# Altium schematic sheet t1-power2.SchDoc
size A3
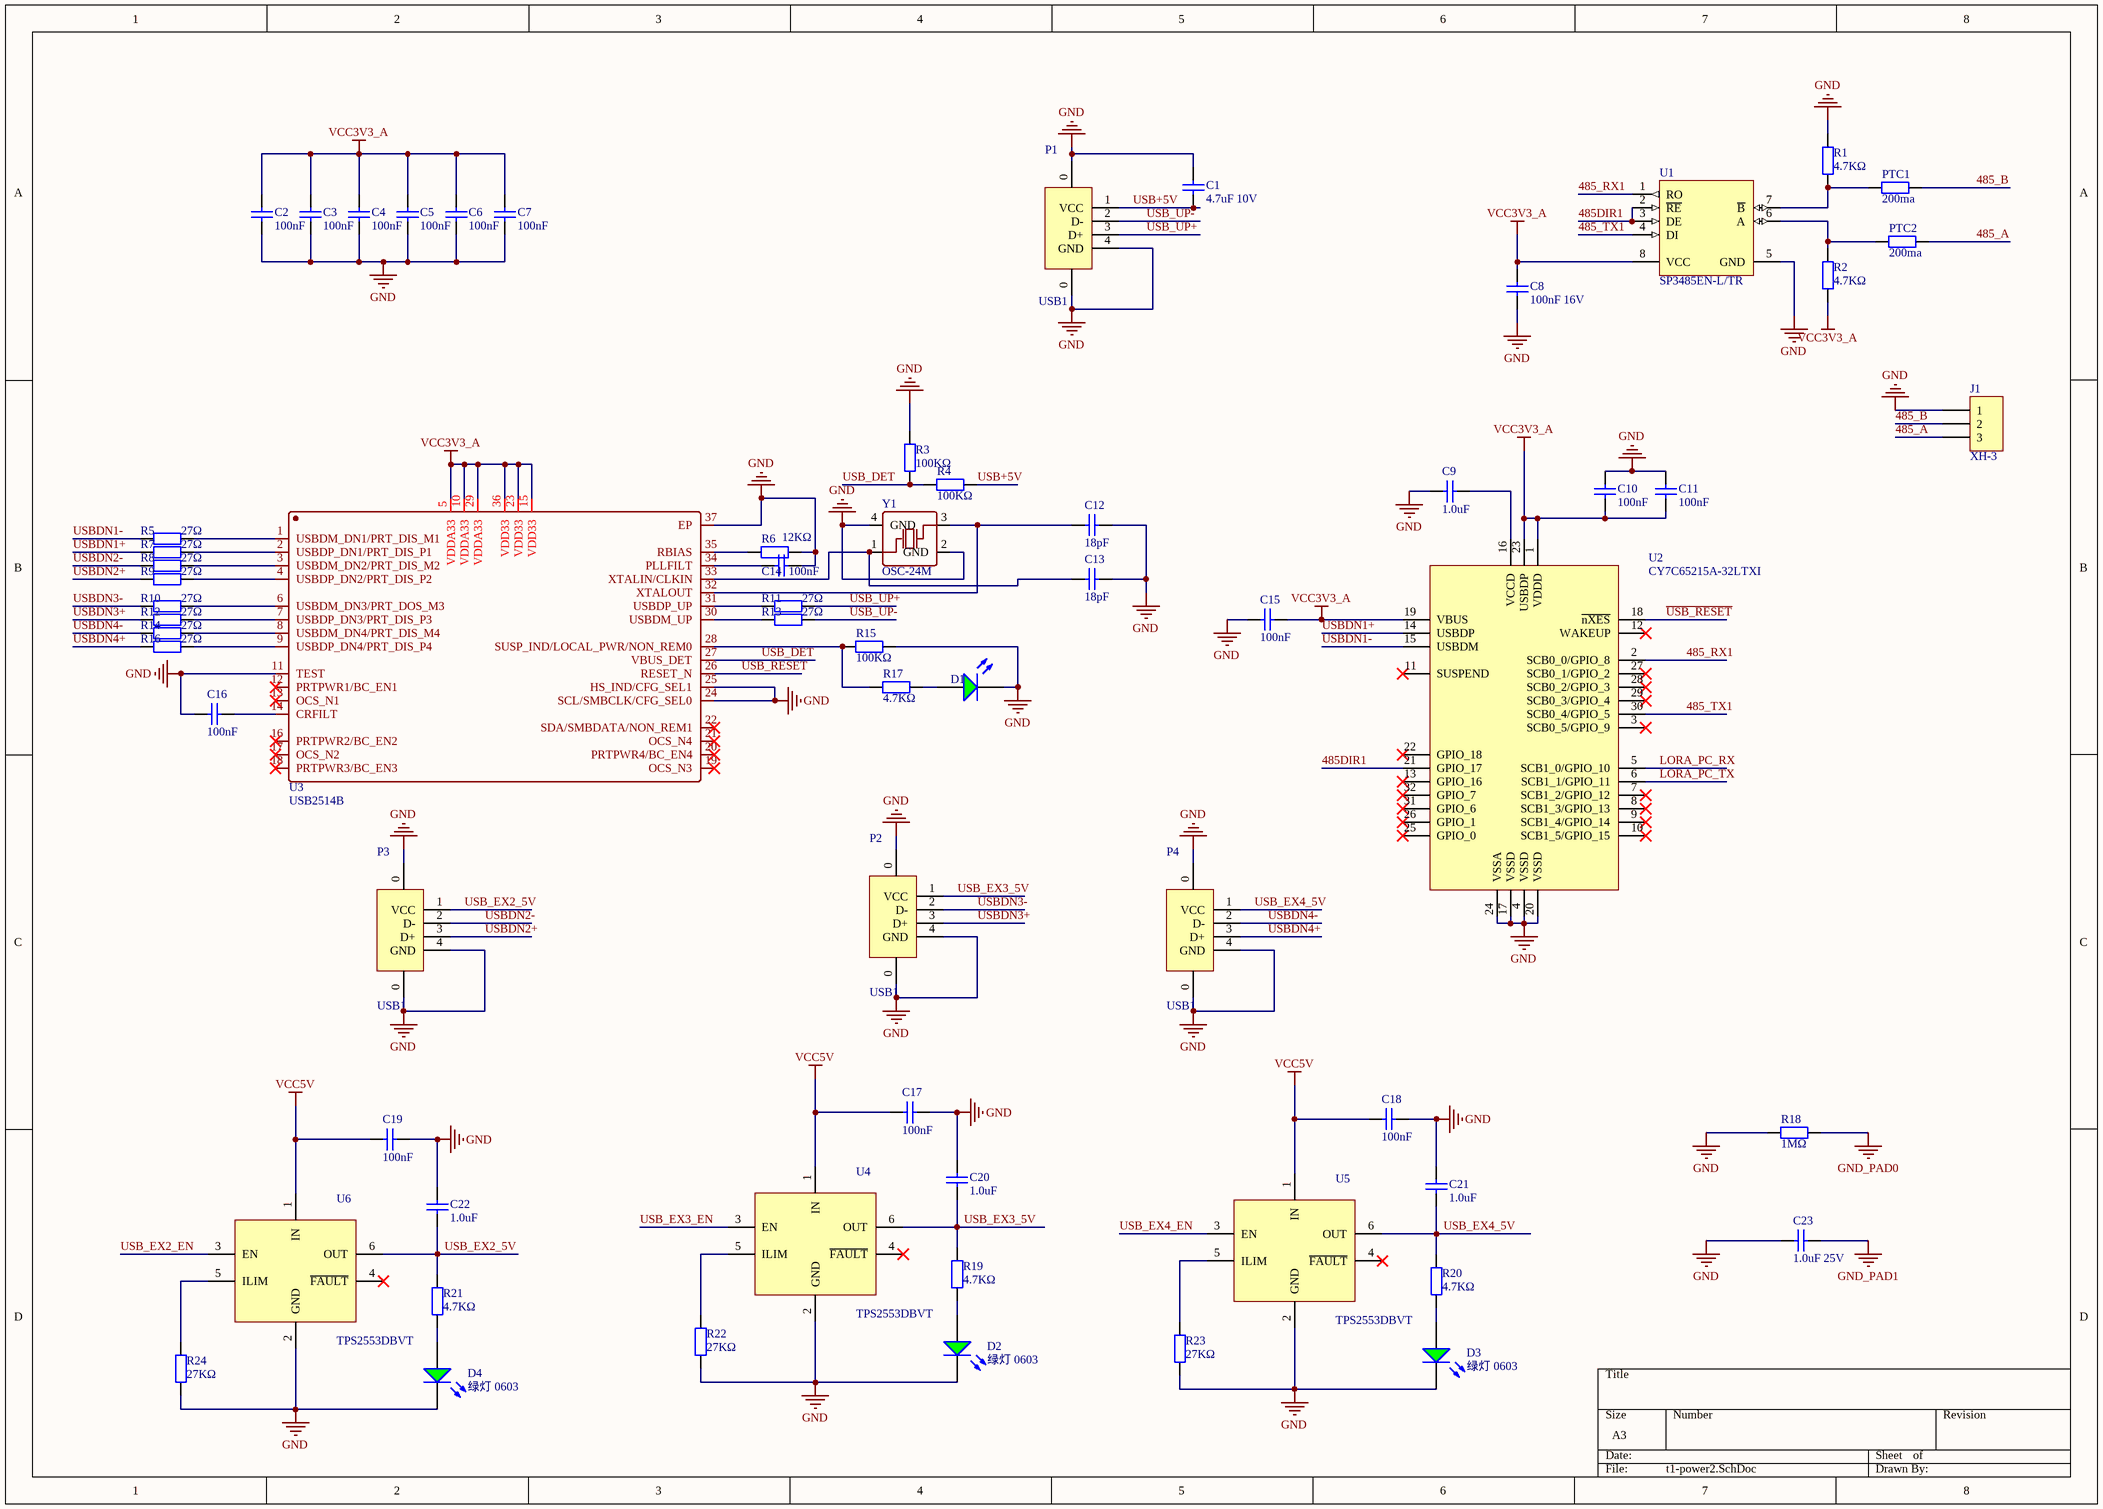
[diagram p0: t1-power2.SchDoc]

## Parts
C1  4.7uF 10V  [0402_C]
C2  100nF  [0402_C]
C3  100nF  [0402_C]
C4  100nF  [0402_C]
C5  100nF  [0402_C]
C6  100nF  [0402_C]
C7  100nF  [0402_C]
C8  100nF 16V  [0402_C]
C9  1.0uF  [0402_C]
C10  100nF  [0402_C]
C11  100nF  [0402_C]
C12  18pF  [0402_C]
C13  18pF  [0402_C]
C14  100nF  [0402_C]
C15  100nF  [0402_C]
C16  100nF  [0402_C]
C17  100nF  [0402_C]
C18  100nF  [0402_C]
C19  100nF  [0402_C]
C20  1.0uF  [0402_C]
C21  1.0uF  [0402_C]
C22  1.0uF  [0402_C]
C23  1.0uF 25V  [0402_C]
D1  绿灯 0603  [0603_LED_S1]  (value not drawn)
D2  绿灯 0603  [0603_LED_S1]
D3  绿灯 0603  [0603_LED_S1]
D4  绿灯 0603  [0603_LED_S1]
J1  XH-3  [ph3-2.0]
P1  USB1  [USB-B]
P2  USB1  [USB - Type A]
P3  USB1  [USB - Type A]
P4  USB1  [USB - Type A]
PTC1  200ma  [0603_R]
PTC2  200ma  [0603_R]
R1  4.7KΩ  [0402_R]
R2  4.7KΩ  [0402_R]
R3  100KΩ  [0402_R]
R4  100KΩ  [0402_R]
R5  27Ω  [0402_R]
R6  12KΩ  [0402_R]
R7  27Ω  [0402_R]
R8  27Ω  [0402_R]
R9  27Ω  [0402_R]
R10  27Ω  [0402_R]
R11  27Ω  [0402_R]
R12  27Ω  [0402_R]
R13  27Ω  [0402_R]
R14  27Ω  [0402_R]
R15  100KΩ  [0402_R]
R16  27Ω  [0402_R]
R17  4.7KΩ  [0402_R]
R18  1MΩ  [0402_R]
R19  4.7KΩ  [0402_R]
R20  4.7KΩ  [0402_R]
R21  4.7KΩ  [0402_R]
R22  27KΩ  [0402_R]
R23  27KΩ  [0402_R]
R24  27KΩ  [0402_R]
U1  SP3485EN-L/TR  [SOIC-8_150mil]
U2  CY7C65215A-32LTXI  [QFN-32_5X5]
U3  USB2514B
U4  TPS2553DBVT  [SOT-23-6]
U5  TPS2553DBVT  [SOT-23-6]
U6  TPS2553DBVT  [SOT-23-6]
Y1  OSC-24M

## Nets
GND: C1.2 C2.1 C3.1 C4.1 C5.1 C6.1 C7.1 C8.1 C9.1 C10.2 C11.2 C12.2 C13.2 C14.2 C15.2 C16.1 C17.2 C18.2 C19.2 C20.2 C21.2 C22.2 C23.1 D1.K D2.K D3.K D4.K J1.1 P1.0 P1.4(GND) P2.0 P2.4(GND) P3.0 P3.4(GND) P4.0 P4.4(GND) R1.2 R3.2 R6.2 R15.2 R18.1 R22.1 R23.1 R24.1 U1.5(GND) U2.4(VSSD) U2.17(VSSD) U2.20(VSSD) U2.24(VSSA) U3.11(TEST) U3.24(SCL/SMBCLK/CFG_SEL0) U3.25(HS_IND/CFG_SEL1) U3.37(EP) U4.2(GND) U5.2(GND) U6.2(GND) Y1.2(GND) Y1.4(GND)
GND_PAD0: R18.2
GND_PAD1: C23.2
VCC3V3_A: C2.2 C3.2 C4.2 C5.2 C6.2 C7.2 C8.2 C10.1 C11.1 C15.1 R2.1 U1.8(VCC) U2.1(VDDD) U2.19(VBUS) U2.23(USBDP) U3.5(VDDA33) U3.10(VDDA33) U3.15(VDD33) U3.23(VDD33) U3.29(VDDA33) U3.36(VDD33)
VCC5V: C17.1 C18.1 C19.1 U4.1(IN) U5.1(IN) U6.1(IN)
485_A: J1.3 PTC2.2
485_B: J1.2 PTC1.2
485_RX1: U1.1(RO) U2.2(SCB0_0/GPIO_8)
485_TX1: U1.4(DI) U2.30(SCB0_4/GPIO_5)
485DIR1: U1.2(~{RE}) U1.3(DE) U2.21(GPIO_17)
LORA_PC_RX: U2.5(SCB1_0/GPIO_10)
LORA_PC_TX: U2.6(SCB1_1/GPIO_11)
~{USB_RESET}: U2.18(~{nXES}) U3.26(RESET_N)
USB+5V: C1.1 P1.1(VCC) R4.2
USB_DET: R3.1 R4.1 U3.27(VBUS_DET)
USB_EX2_5V: C22.1 P3.1(VCC) R21.2 U6.6(OUT)
USB_EX2_EN: U6.3(EN)
USB_EX3_5V: C20.1 P2.1(VCC) R19.2 U4.6(OUT)
USB_EX3_EN: U4.3(EN)
USB_EX4_5V: C21.1 P4.1(VCC) R20.2 U5.6(OUT)
USB_EX4_EN: U5.3(EN)
USB_UP+: P1.3(D+) R11.2
USB_UP-: P1.2(D-) R13.2
USBDN1+: R7.1 U2.14(USBDP)
USBDN1-: R5.1 U2.15(USBDM)
USBDN2+: P3.3(D+) R9.1
USBDN2-: P3.2(D-) R8.1
USBDN3+: P2.3(D+) R12.1
USBDN3-: P2.2(D-) R10.1
USBDN4+: P4.3(D+) R16.1
USBDN4-: P4.2(D-) R14.1
NetC9_2: C9.2 U2.16(VCCD)
NetC12_1: C12.1 U3.32(XTALOUT) Y1.3(OSC2)
NetC13_1: C13.1 U3.33(XTALIN/CLKIN) Y1.1(OSC1)
NetC14_1: C14.1 U3.34(PLLFILT)
NetC16_2: C16.2 U3.14(CRFILT)
NetD1_A: D1.A R17.2
NetD2_A: D2.A R19.1
NetD3_A: D3.A R20.1
NetD4_A: D4.A R21.1
NetPTC1_1: PTC1.1 R1.1 U1.7(~{B})
NetPTC2_1: PTC2.1 R2.2 U1.6(A)
NetR5_2: R5.2 U3.1(USBDM_DN1/PRT_DIS_M1)
NetR6_1: R6.1 U3.35(RBIAS)
NetR7_2: R7.2 U3.2(USBDP_DN1/PRT_DIS_P1)
NetR8_2: R8.2 U3.3(USBDM_DN2/PRT_DIS_M2)
NetR9_2: R9.2 U3.4(USBDP_DN2/PRT_DIS_P2)
NetR10_2: R10.2 U3.6(USBDM_DN3/PRT_DOS_M3)
NetR11_1: R11.1 U3.31(USBDP_UP)
NetR12_2: R12.2 U3.7(USBDP_DN3/PRT_DIS_P3)
NetR13_1: R13.1 U3.30(USBDM_UP)
NetR14_2: R14.2 U3.8(USBDM_DN4/PRT_DIS_M4)
NetR15_1: R15.1 R17.1 U3.28(SUSP_IND/LOCAL_PWR/NON_REM0)
NetR16_2: R16.2 U3.9(USBDP_DN4/PRT_DIS_P4)
NetR22_2: R22.2 U4.5(ILIM)
NetR23_2: R23.2 U5.5(ILIM)
NetR24_2: R24.2 U6.5(ILIM)

Not connected (* = marked no-connect by the designer): U2 3(SCB0_5/GPIO_9)* 7(SCB1_2/GPIO_12)* 8(SCB1_3/GPIO_13)* 9(SCB1_4/GPIO_14)* 10(SCB1_5/GPIO_15)* 11(SUSPEND)* 12(WAKEUP)* 13(GPIO_16)* 22(GPIO_18)* 25(GPIO_0)* 26(GPIO_1)* 27(SCB0_1/GPIO_2)* 28(SCB0_2/GPIO_3)* 29(SCB0_3/GPIO_4)* 31(GPIO_6)* 32(GPIO_7)*; U3 12(PRTPWR1/BC_EN1)* 13(OCS_N1)* 16(PRTPWR2/BC_EN2)* 17(OCS_N2)* 18(PRTPWR3/BC_EN3)* 19(OCS_N3)* 20(PRTPWR4/BC_EN4)* 21(OCS_N4)* 22(SDA/SMBDATA/NON_REM1)*; U4 4(~{FAULT})*; U5 4(~{FAULT})*; U6 4(~{FAULT})*

## Library data of the parts
C1 = 0402 4.7uF (475) 20% 10V: 贴片电容; ComponentLink1Description: 供应商链接; ComponentLink1URL: http://www.szlcsc.com/product/details_24469.html; Package: 0402; Supplier: LC; SuppliersPartNumber: C23733
C2-C8 C10 C11 C14-C19 = 0402 100nF (104) 10% 16V: 贴片电容; ComponentLink1Description: 供应商链接; ComponentLink1URL: http://www.szlcsc.com/product/details_1877.html; Package: 0402; Supplier: LC; SuppliersPartNumber: C1525
C9 C20-C23 = 0402 1.0uF (105) 10% 25V: 贴片电容; ComponentLink1Description: 供应商链接; ComponentLink1URL: http://www.szlcsc.com/product/details_53938.html; Package: 0402; Supplier: LC; SuppliersPartNumber: C52923
C12 C13 = 0402 18pF (180) 5% 50V: 贴片电容; ComponentLink1Description: 供应商链接; ComponentLink1URL: http://www.szlcsc.com/product/details_1901.html; Package: 0402; Supplier: LC; SuppliersPartNumber: C1549
D1-D4 = 0603 绿灯: 发光二极管; ComponentLink1Description: 供应商链接; ComponentLink1URL: http://www.szlcsc.com/product/details_73152.html; Package: 0603; Supplier: LC; SuppliersPartNumber: C72043
PTC1 PTC2 = 0603 910Ω (9100) 1%: 贴片电阻; ComponentLink1Description: 供应商链接; ComponentLink1URL: http://www.szlcsc.com/product/details_23991.html; Package: 0603; Supplier: LC; SuppliersPartNumber: C23264
R1 R2 R17 R19-R21 = 0402 4.7KΩ (4701) 1%: 贴片电阻; ComponentLink1Description: 供应商链接; ComponentLink1URL: http://www.szlcsc.com/product/details_26643.html; Package: 0402; Supplier: LC; SuppliersPartNumber: C25900
R3 R4 R15 = 0402 100KΩ (1003) 1%: 贴片电阻; ComponentLink1Description: 供应商链接; ComponentLink1URL: http://www.szlcsc.com/product/details_26484.html; Package: 0402; Supplier: LC; SuppliersPartNumber: C25741
R5 R7-R14 R16 R22-R24 = 0402 27KΩ (2702) 1%: 贴片电阻; ComponentLink1Description: 供应商链接; ComponentLink1URL: http://www.szlcsc.com/product/details_26514.html; Package: 0402; Supplier: LC; SuppliersPartNumber: C25771
R6 = 0402 12KΩ (1202) 1%: 贴片电阻; ComponentLink1Description: 供应商链接; ComponentLink1URL: http://www.szlcsc.com/product/details_26495.html; Package: 0402; Supplier: LC; SuppliersPartNumber: C25752
R18 = 0402 1MΩ (1004) 1%: 贴片电阻; ComponentLink1Description: 供应商链接; ComponentLink1URL: http://www.szlcsc.com/product/details_26826.html; Package: 0402; Supplier: LC; SuppliersPartNumber: C26083
U1 = SP3485EN-L/TR_[C8963]: RS-485/RS-422; ComponentLink1Description: 供应商链接; ComponentLink1URL: http://www.szlcsc.com/product/details_9482.html; Package: SOIC-8; Supplier: LC; SuppliersPartNumber: C8963
U4-U6 = TPS2553DBVT: SOT-23-6
Y1 = OSC-24M: SMD-3225_4P